# Altium schematic sheet P1_CCD_CAM_BOARD_OVERVIEW.SchDoc
size A3
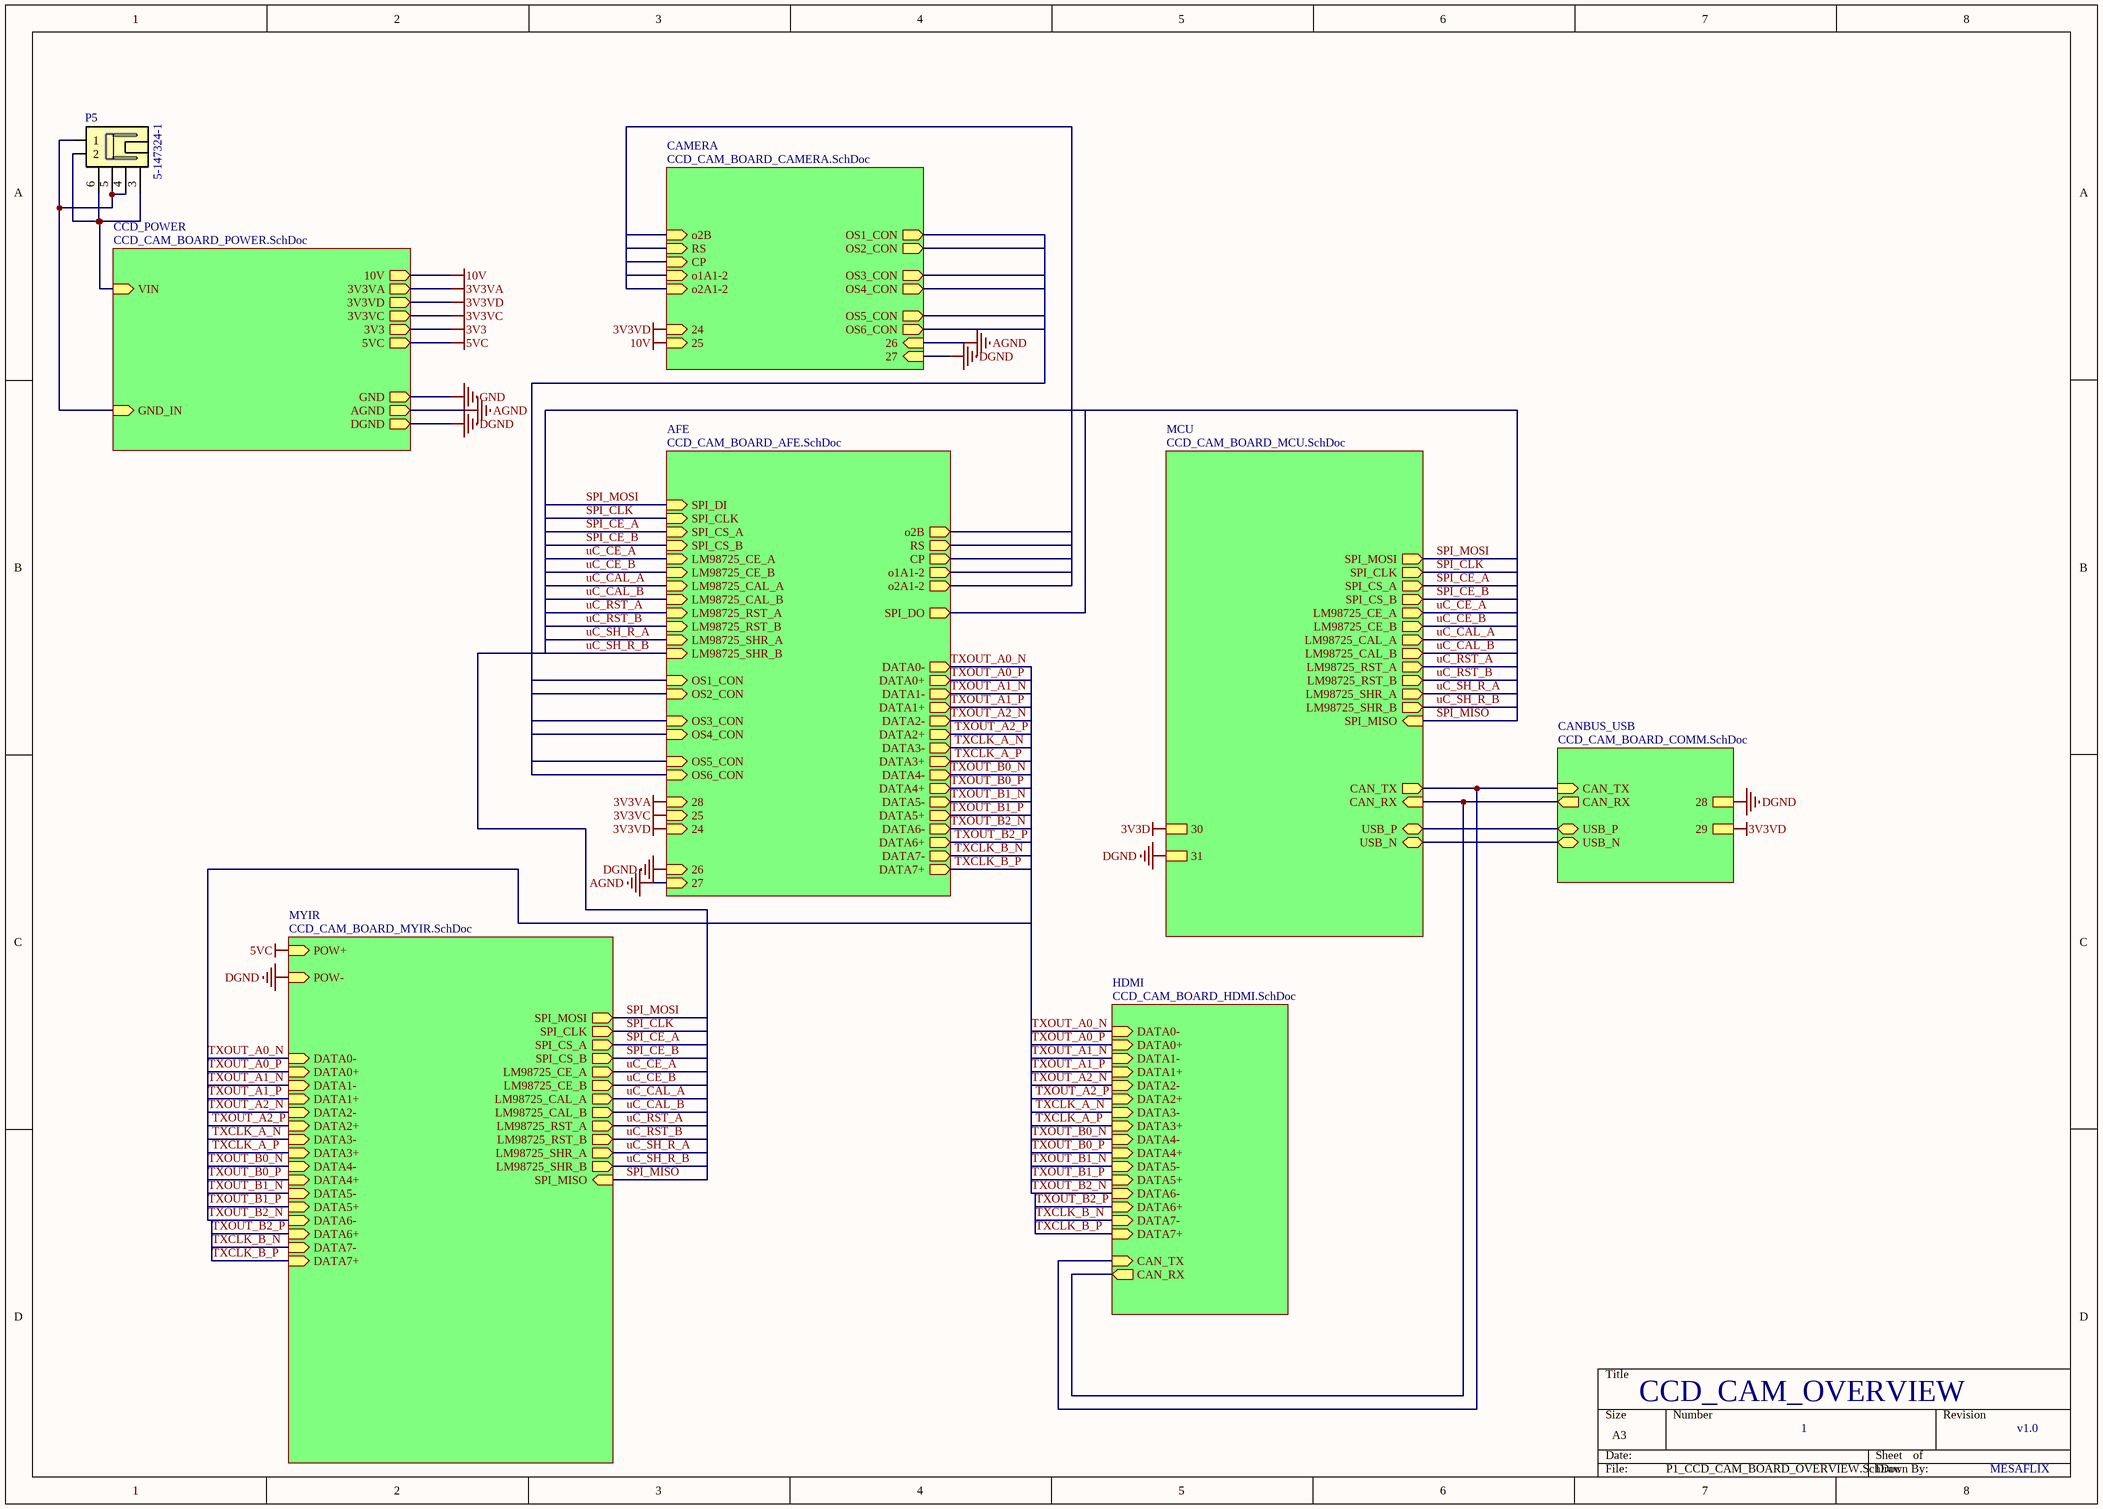
[diagram p0: P1_CCD_CAM_BOARD_OVERVIEW.SchDoc]

## Parts
P5  5-147324-1  [TE_5-147324-1]

## Sub-sheets
AFE = CCD_CAM_BOARD_AFE.SchDoc: SPI_CLK (in), SPI_CS_A (in), SPI_CS_B (in), LM98725_CE_A (in), LM98725_CE_B (in), LM98725_CAL_A (in), LM98725_CAL_B (in), LM98725_RST_A (in), LM98725_RST_B (in), LM98725_SHR_A (in), LM98725_SHR_B (in), OS2_CON (in), OS3_CON (in), OS4_CON (in), OS1_CON (in), OS5_CON (in), OS6_CON (in), o2B (out), RS (out), CP (out), o1A1-2 (out), o2A1-2 (out), SPI_DO (out), SPI_DI (in), DATA0- (out), DATA0+ (out), DATA1- (out), DATA1+ (out), DATA2- (out), DATA2+ (out), DATA3- (out), DATA4- (out), DATA4+ (out), DATA5- (out), DATA5+ (out), DATA6- (out), DATA6+ (out), DATA7- (out), DATA7+ (out), DATA3+ (out), 24 (in), 26 (in), 27 (in), 25 (in), 28 (in)
CAMERA = CCD_CAM_BOARD_CAMERA.SchDoc: OS2_CON (out), OS3_CON (out), OS4_CON (out), OS1_CON (out), OS5_CON (out), OS6_CON (out), o2B (in), RS (in), CP (in), o1A1-2 (in), o2A1-2 (in), 24 (in), 25 (in), 26 (in), 27 (in)
CANBUS_USB = CCD_CAM_BOARD_COMM.SchDoc: CAN_TX (in), CAN_RX (out), USB_P (bidir), USB_N (bidir), 28, 29
CCD_POWER = CCD_CAM_BOARD_POWER.SchDoc: VIN (in), GND_IN (in), 3V3VA (out), AGND (out), GND (out), DGND (out), 3V3VD (out), 3V3VC (out), 10V (out), 3V3 (out), 5VC (out)
HDMI = CCD_CAM_BOARD_HDMI.SchDoc: DATA0- (in), DATA0+ (in), DATA1- (in), DATA1+ (in), DATA2- (in), DATA2+ (in), DATA3- (in), DATA4- (in), DATA4+ (in), DATA5- (in), DATA5+ (in), DATA6- (in), DATA6+ (in), DATA7- (in), DATA7+ (in), DATA3+ (in), CAN_TX (in), CAN_RX (out)
MCU = CCD_CAM_BOARD_MCU.SchDoc: SPI_MOSI (out), SPI_CLK (out), SPI_CS_A (out), SPI_CS_B (out), LM98725_CE_A (out), LM98725_CE_B (out), LM98725_CAL_A (out), LM98725_CAL_B (out), LM98725_RST_A (out), LM98725_RST_B (out), LM98725_SHR_A (out), LM98725_SHR_B (out), CAN_TX (out), CAN_RX (in), USB_P (bidir), USB_N (bidir), SPI_MISO (in), 30, 31
MYIR = CCD_CAM_BOARD_MYIR.SchDoc: SPI_MOSI (out), SPI_CLK (out), SPI_CS_A (out), SPI_CS_B (out), LM98725_CE_A (out), LM98725_CE_B (out), LM98725_CAL_A (out), LM98725_CAL_B (out), LM98725_RST_A (out), LM98725_RST_B (out), LM98725_SHR_A (out), LM98725_SHR_B (out), SPI_MISO (in), DATA0- (in), DATA0+ (in), DATA1- (in), DATA1+ (in), DATA2- (in), DATA2+ (in), DATA3- (in), DATA4- (in), DATA4+ (in), DATA5- (in), DATA5+ (in), DATA6- (in), DATA6+ (in), DATA7- (in), DATA7+ (in), DATA3+ (in), POW+ (in), POW- (in)

## Nets
3V3: sheet CCD_POWER/3V3
3V3D: sheet MCU/30
3V3VA: sheet CCD_POWER/3V3VA, sheet AFE/28
3V3VC: sheet CCD_POWER/3V3VC, sheet AFE/25
3V3VD: sheet CCD_POWER/3V3VD, sheet CAMERA/24, sheet CANBUS_USB/29, sheet AFE/24
5VC: sheet CCD_POWER/5VC, sheet MYIR/POW+
10V: sheet CCD_POWER/10V, sheet CAMERA/25
AGND: sheet CCD_POWER/AGND, sheet CAMERA/26, sheet AFE/27
DGND: sheet CCD_POWER/DGND, sheet CAMERA/27, sheet MCU/31, sheet CANBUS_USB/28, sheet AFE/26, sheet MYIR/POW-
GND: sheet CCD_POWER/GND
~{SPI_CE_A}: sheet MCU/SPI_CS_A, sheet AFE/SPI_CS_A, sheet MYIR/SPI_CS_A
~{SPI_CE_B}: sheet MCU/SPI_CS_B, sheet AFE/SPI_CS_B, sheet MYIR/SPI_CS_B
SPI_CLK: sheet MCU/SPI_CLK, sheet AFE/SPI_CLK, sheet MYIR/SPI_CLK
SPI_MISO: sheet MCU/SPI_MISO, sheet MYIR/SPI_MISO
SPI_MOSI: sheet MCU/SPI_MOSI, sheet AFE/SPI_DI, sheet MYIR/SPI_MOSI
TXCLK_A_N: sheet HDMI/DATA3-, sheet AFE/DATA3-, sheet MYIR/DATA3-
TXCLK_A_P: sheet HDMI/DATA3+, sheet AFE/DATA3+, sheet MYIR/DATA3+
TXCLK_B_N: sheet HDMI/DATA7-, sheet AFE/DATA7-, sheet MYIR/DATA7-
TXCLK_B_P: sheet HDMI/DATA7+, sheet AFE/DATA7+, sheet MYIR/DATA7+
TXOUT_A0_N: sheet HDMI/DATA0-, sheet AFE/DATA0-, sheet MYIR/DATA0-
TXOUT_A0_P: sheet HDMI/DATA0+, sheet AFE/DATA0+, sheet MYIR/DATA0+
TXOUT_A1_N: sheet HDMI/DATA1-, sheet AFE/DATA1-, sheet MYIR/DATA1-
TXOUT_A1_P: sheet HDMI/DATA1+, sheet AFE/DATA1+, sheet MYIR/DATA1+
TXOUT_A2_N: sheet HDMI/DATA2-, sheet AFE/DATA2-, sheet MYIR/DATA2-
TXOUT_A2_P: sheet HDMI/DATA2+, sheet AFE/DATA2+, sheet MYIR/DATA2+
TXOUT_B0_N: sheet HDMI/DATA4-, sheet AFE/DATA4-, sheet MYIR/DATA4-
TXOUT_B0_P: sheet HDMI/DATA4+, sheet AFE/DATA4+, sheet MYIR/DATA4+
TXOUT_B1_N: sheet HDMI/DATA5-, sheet AFE/DATA5-, sheet MYIR/DATA5-
TXOUT_B1_P: sheet HDMI/DATA5+, sheet AFE/DATA5+, sheet MYIR/DATA5+
TXOUT_B2_N: sheet HDMI/DATA6-, sheet AFE/DATA6-, sheet MYIR/DATA6-
TXOUT_B2_P: sheet HDMI/DATA6+, sheet AFE/DATA6+, sheet MYIR/DATA6+
~{uC_RST_A}: sheet MCU/LM98725_RST_A, sheet AFE/LM98725_RST_A, sheet MYIR/LM98725_RST_A
~{uC_RST_B}: sheet MCU/LM98725_RST_B, sheet AFE/LM98725_RST_B, sheet MYIR/LM98725_RST_B
uC_CAL_A: sheet MCU/LM98725_CAL_A, sheet AFE/LM98725_CAL_A, sheet MYIR/LM98725_CAL_A
uC_CAL_B: sheet MCU/LM98725_CAL_B, sheet AFE/LM98725_CAL_B, sheet MYIR/LM98725_CAL_B
uC_CE_A: sheet MCU/LM98725_CE_A, sheet AFE/LM98725_CE_A, sheet MYIR/LM98725_CE_A
uC_CE_B: sheet MCU/LM98725_CE_B, sheet AFE/LM98725_CE_B, sheet MYIR/LM98725_CE_B
uC_SH_R_A: sheet MCU/LM98725_SHR_A, sheet AFE/LM98725_SHR_A, sheet MYIR/LM98725_SHR_A
uC_SH_R_B: sheet MCU/LM98725_SHR_B, sheet AFE/LM98725_SHR_B, sheet MYIR/LM98725_SHR_B
NetP5_1: P5.1 P5.4(SHIELD) P5.5(SHIELD) ; sheet CCD_POWER/GND_IN
NetP5_2: P5.2 P5.3(SHIELD) P5.6(SHIELD) ; sheet CCD_POWER/VIN
(unnamed): sheet MCU/CAN_TX, sheet CANBUS_USB/CAN_TX, sheet HDMI/CAN_TX
(unnamed): sheet MCU/CAN_RX, sheet CANBUS_USB/CAN_RX, sheet HDMI/CAN_RX
(unnamed): sheet MCU/USB_P, sheet CANBUS_USB/USB_P
(unnamed): sheet MCU/USB_N, sheet CANBUS_USB/USB_N

## Notes on the sheet
- CCD_CAM_OVERVIEW
- 1
- v1.0
- MESAFLIX

## Library data of the parts
P5 = SMDHDR1x2-RA: HEADER SMD R/A 2POS 2.54MM; LatestRevisionDate: 17-Jul-2002; LatestRevisionNote: Re-released for DXP Platform.; Publisher: Altium Limited